# Altium schematic sheet power.SchDoc
size A
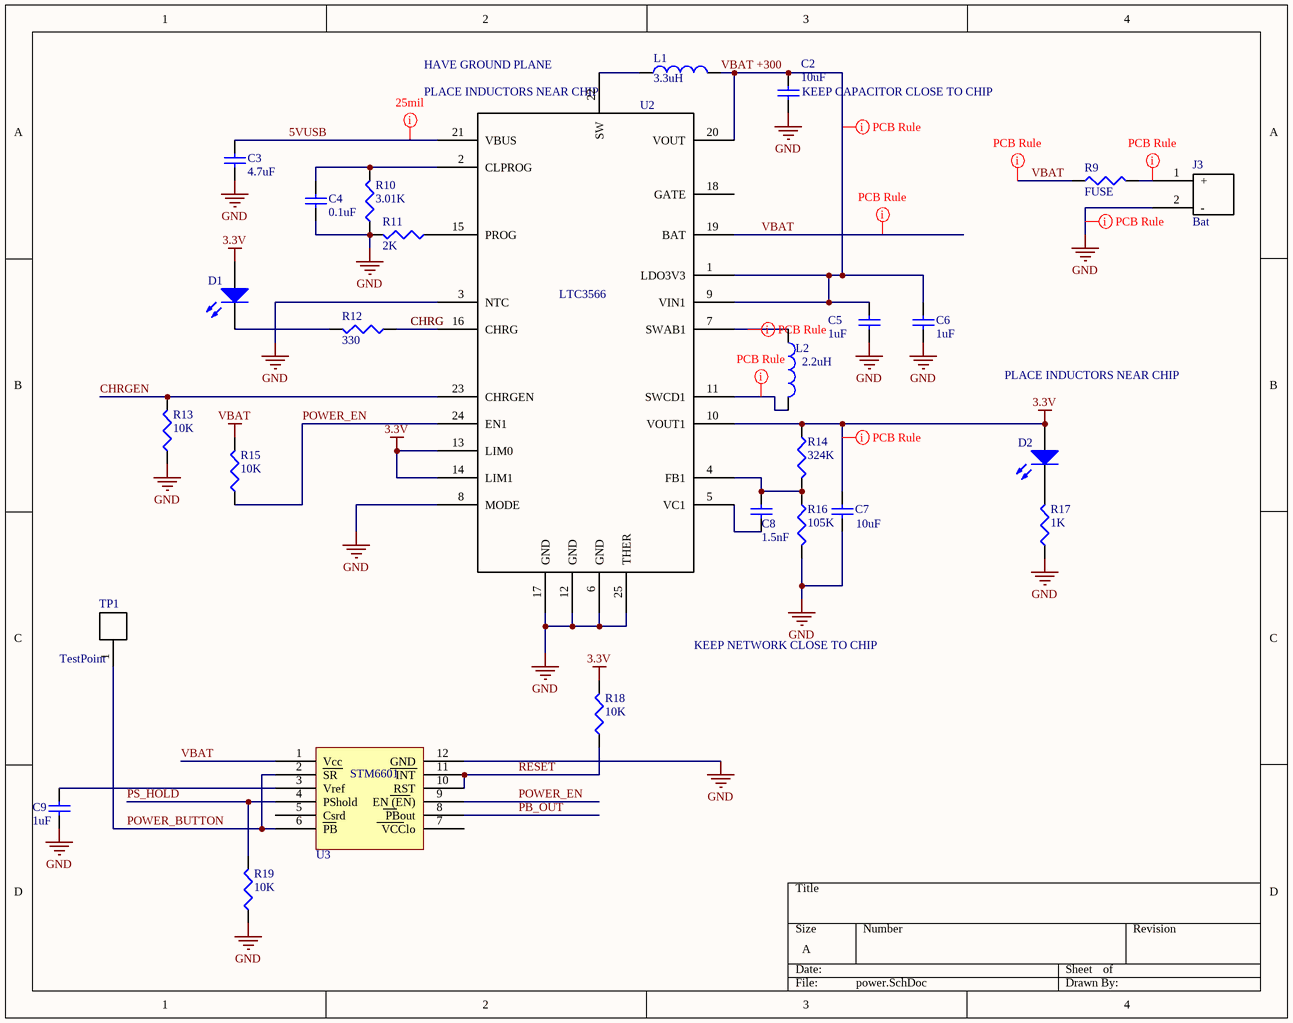
[diagram p0: power.SchDoc]

## Parts
C2  value 10uF  [CAPC1608L]  (hidden comment: Cap)
C3  value 4.7uF  [CAPC1608L]  (hidden comment: Cap)
C4  value 0.1uF  [CAPC1005L]  (hidden comment: Cap)
C5  value 1uF  [CAPC1608L]  (hidden comment: Cap)
C6  value 1uF  [CAPC1608L]  (hidden comment: Cap)
C7  value 10uF  [CAPC1608L]  (hidden comment: Cap)
C8  value 1.5nF  [CAPC1005L]  (hidden comment: Cap)
C9  value 1uF  [CAPC1608L]  (hidden comment: Cap)
D1  Charge  [INDC2012L]  (value not drawn)
D2  Power  [INDC2012L]  (value not drawn)
J3  Bat  [BatteryConnJST]
L1  3.3uH  [IndPow]
L2  2.2uH  [IndPow]
R9  value FUSE  [RESC3225L]  (hidden comment: Res3)
R10  value 3.01K  [RESC1608L]  (hidden comment: Res3)
R11  value 2K  [RESC1608L]  (hidden comment: Res3)
R12  value 330  [RESC1608L]  (hidden comment: Res3)
R13  value 10K  [RESC1608L]  (hidden comment: Res3)
R14  value 324K  [RESC1608L]  (hidden comment: Res3)
R15  value 10K  [RESC1608L]  (hidden comment: Res3)
R16  value 105K  [RESC1608L]  (hidden comment: Res3)
R17  value 1K  [RESC1608L]  (hidden comment: Res3)
R18  value 10K  [RESC1608L]  (hidden comment: Res3)
R19  value 10K  [RESC1608L]  (hidden comment: Res3)
TP1  TestPoint  [TestPoint]
U2  LTC3566  [QFN-24]
U3  STM6601  [TDFN12]

## Nets
3.3V: C7.2 D1.1(A) D2.1(A) R14.1 R18.2 U2.10(VOUT1) U2.13(LIM0) U2.14(LIM1)
GND: C2.1 C3.1 C4.1 C5.2 C6.2 C7.1 C9.2 J3.2(-) R10.1 R11.2 R13.1 R16.2 R17.1 R19.1 U2.3(NTC) U2.6(GND) U2.8(MODE) U2.12(GND) U2.17(GND) U2.25(THER) U3.12(GND)
VBAT: R9.1 R15.2 U2.19(BAT) U3.1(Vcc)
5VUSB: C3.2 U2.21(VBUS)
CHRG: R12.1 U2.16(CHRG)
CHRGEN: R13.2 U2.23(CHRGEN)
PB_OUT: U3.8(PBout)
POWER_BUTTON: TP1.1 U3.2(SR) U3.6(PB)
POWER_EN: R15.1 U2.24(EN1) U3.9(EN_(EN))
PS_HOLD: R19.2 U3.4(PShold)
RESET: R18.1 U3.10(RST) U3.11(INT)
VBAT +300: C2.2 C5.1 C6.1 L1.2 U2.1(LDO3V3) U2.9(VIN1) U2.20(VOUT)
NetC4_2: C4.2 R10.2 U2.2(CLPROG)
NetC8_1: C8.1 R14.2 R16.1 U2.4(FB1)
NetC8_2: C8.2 U2.5(VC1)
NetC9_1: C9.1 U3.3(Vref)
NetD1_2: D1.2(K) R12.2
NetD2_2: D2.2(K) R17.2
NetJ3_1: J3.1(+) R9.2
NetL1_1: L1.1 U2.22(SW)
NetL2_1: L2.1 U2.7(SWAB1)
NetL2_2: L2.2 U2.11(SWCD1)
NetR11_1: R11.1 U2.15(PROG)

Not connected (* = marked no-connect by the designer): U2 18(GATE); U3 5(Csrd) 7(VCClo)

## Layout directives
rule Width Constraint [Pref Width = 25mil    Min Width = 10mil    Max Width = 25mil]: 5VUSB, GND, NetJ3_1, NetL2_1, NetL2_2, VBAT, VBAT +300
rule Width Constraint [Pref Width = 25mil    Min Width = 10mil    Max Width = 100mil]: 3.3V
rule Width Constraint [Pref Width = 25mil    Min Width = 10mil    Max Width = 50mil]: VBAT

## Notes on the sheet
- (near U2) HAVE GROUND PLANE
- (near U2) PLACE INDUCTORS NEAR CHIP
- (near C2) KEEP CAPACITOR CLOSE TO CHIP
- CHRG
- PLACE INDUCTORS NEAR CHIP
- KEEP NETWORK CLOSE TO CHIP

## Library data of the parts
C2-C9 = Cap: Capacitor; Published: 8-Jun-2000; LatestRevisionDate: 17-Jul-2002; LatestRevisionNote: Re-released for DXP Platform.; PackageReference: RAD-0.3; Publisher: Altium Limited
D1 D2 = LED2: Typical RED, GREEN, YELLOW, AMBER GaAs LED; Published: 8-Jun-2000; LatestRevisionDate: 17-Jul-2002; LatestRevisionNote: Re-released for DXP Platform.; PackageVersion: Feb-2002; PackageReference: 3.2X1.6X1.1; Publisher: Altium Limited
J3 = BatteryConnJST
L1 L2 = Inductor
  L1: Value: 3.3uH
  L2: Value: 2.2uH
R9-R19 = Res3: Resistor; Published: 8-Jun-2000; LatestRevisionDate: 29-May-2009; LatestRevisionNote: IPC-7351 Footprint Added.; PackageReference: J1-0603; Publisher: Altium Limited; PackageDescription: Chip Resistor